# Altium schematic sheet Sheet1.SchDoc
size A4
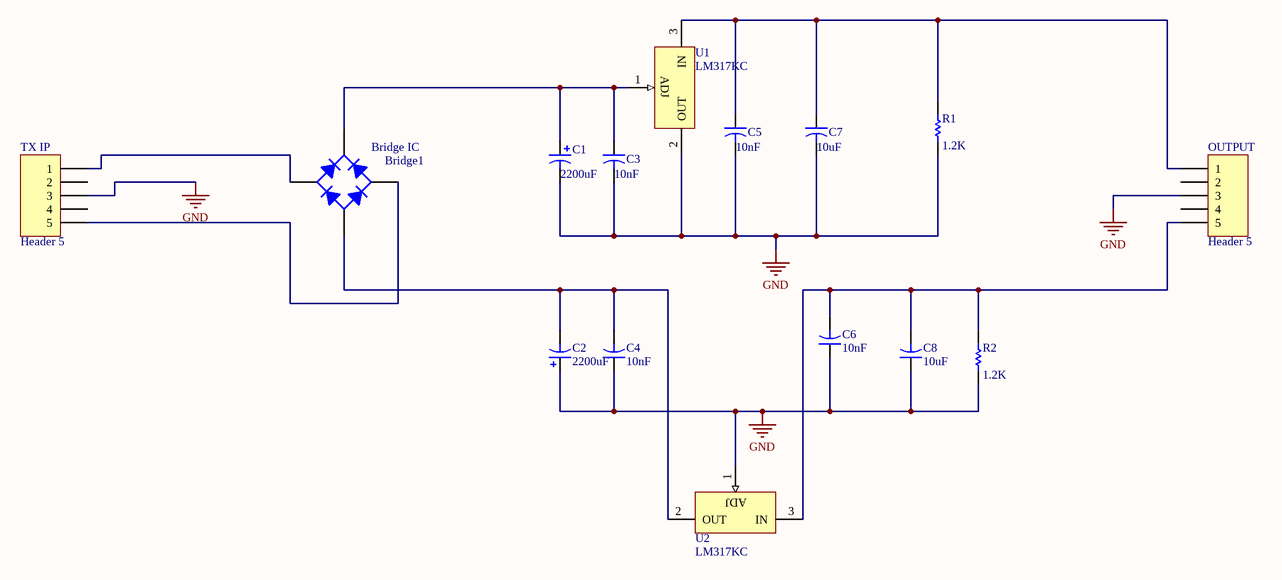
[diagram p0: Sheet1.SchDoc]

## Parts
Bridge_IC  Bridge1  [D-38]
C1  value 2200uF  [RB7.6-15]  (hidden comment: Cap Pol1)
C2  value 2200uF  [RB7.6-15]  (hidden comment: Cap Pol1)
C3  value 10nF  [CAPR5-4X5]  (hidden comment: Cap2)
C4  value 10nF  [CAPR5-4X5]  (hidden comment: Cap2)
C5  value 10nF  [CAPR5-4X5]  (hidden comment: Cap2)
C6  value 10nF  [CAPR5-4X5]  (hidden comment: Cap2)
C7  value 10uF  [CAPR5-4X5]  (hidden comment: Cap4)
C8  value 10uF  [CAPR5-4X5]  (hidden comment: Cap4)
OUTPUT  Header 5  [HDR1X5]
R1  value 1.2K  [AXIAL-0.3]  (hidden comment: res)
R2  value 1.2K  [AXIAL-0.3]  (hidden comment: res)
TX_IP  Header 5  [HDR1X5]
U1  LM317KC  [KC03]
U2  LM317KC  [KC03]

## Nets
GND: C1.2 C2.1 C3.2 C4.1 C5.2 C6.1 C7.2 C8.1 OUTPUT.3 R1.1 R2.1 TX_IP.3 U1.2(OUT) U2.1(ADJ)
NetBridge_IC_1: Bridge_IC.1(K) C1.1 C3.1 U1.1(ADJ)
NetBridge_IC_2: Bridge_IC.2(C) TX_IP.5
NetBridge_IC_3: Bridge_IC.3(A) C2.2 C4.2 U2.2(OUT)
NetBridge_IC_4: Bridge_IC.4(C) TX_IP.1
NetC5_1: C5.1 C7.1 OUTPUT.1 R1.2 U1.3(IN)
NetC6_2: C6.2 C8.2 OUTPUT.5 R2.2 U2.3(IN)

Not connected (* = marked no-connect by the designer): OUTPUT 2 4; TX_IP 2 4

## Library data of the parts
Bridge_IC = Bridge1: Full Wave Diode Bridge; Published: 8-Jun-2000; LatestRevisionDate: 29-May-2009; LatestRevisionNote: Sch pins A & K swapped.; DatasheetVersion: E2732B; PackageReference: D-38; Publisher: Altium Limited; PackageDescription: Bridge Rectifier; 4 Terminals; Body 9.4 x 9.4 mm (typ); Pitch 5.08 mm
C1 C2 = Cap Pol1: Polarized Capacitor (Radial); Published: 8-Jun-2000; LatestRevisionDate: 17-Jul-2002; LatestRevisionNote: Re-released for DXP Platform.; PackageReference: RB7.6-15; Publisher: Altium Limited; PackageDescription: Polarized Capacitor (Radial); 2 Leads
C3-C8 = Cap2: Capacitor; Published: 23-Sep-2002; PackageReference: CAPR5-4X5; Publisher: Altium Limited; PackageDescription: Capacitor; 2 Leads
OUTPUT TX_IP = Header 5: Header, 5-Pin; LatestRevisionDate: 17-Jul-2002; LatestRevisionNote: Re-released for DXP Platform.; Publisher: Altium Limited
R1 R2 = Res1: Resistor; Published: 8-Jun-2000; LatestRevisionDate: 17-Jul-2002; LatestRevisionNote: Re-released for DXP Platform.; PackageReference: AXIAL-0.3; Publisher: Altium Limited; PackageDescription: Axial Device, Thru-Hole; 2 Leads; 0.3 in Pin Spacing
U1 U2 = LM317KC: 3-Terminal Adjustable Regulator; Note: Pin 2 is electrically connected to tab; Published: 15-Apr-2002; DatasheetVersion: Feb-1988; PackageVersion: Sep-1995; PackageReference: KC03; Publisher: Altium Limited; PackageDescription: TO, Thru-Hole, Vertical, Heatsink Mounted; 3 In-Line Leads; Pitch 2.54 mm; ComponentLink1Description: Manufacturer Link; ComponentLink1URL: http://www.ti.com/